# Altium schematic sheet CO2_THP_Sensor.SchDoc
size A; SheetNumber: 10; SheetTotal: 10
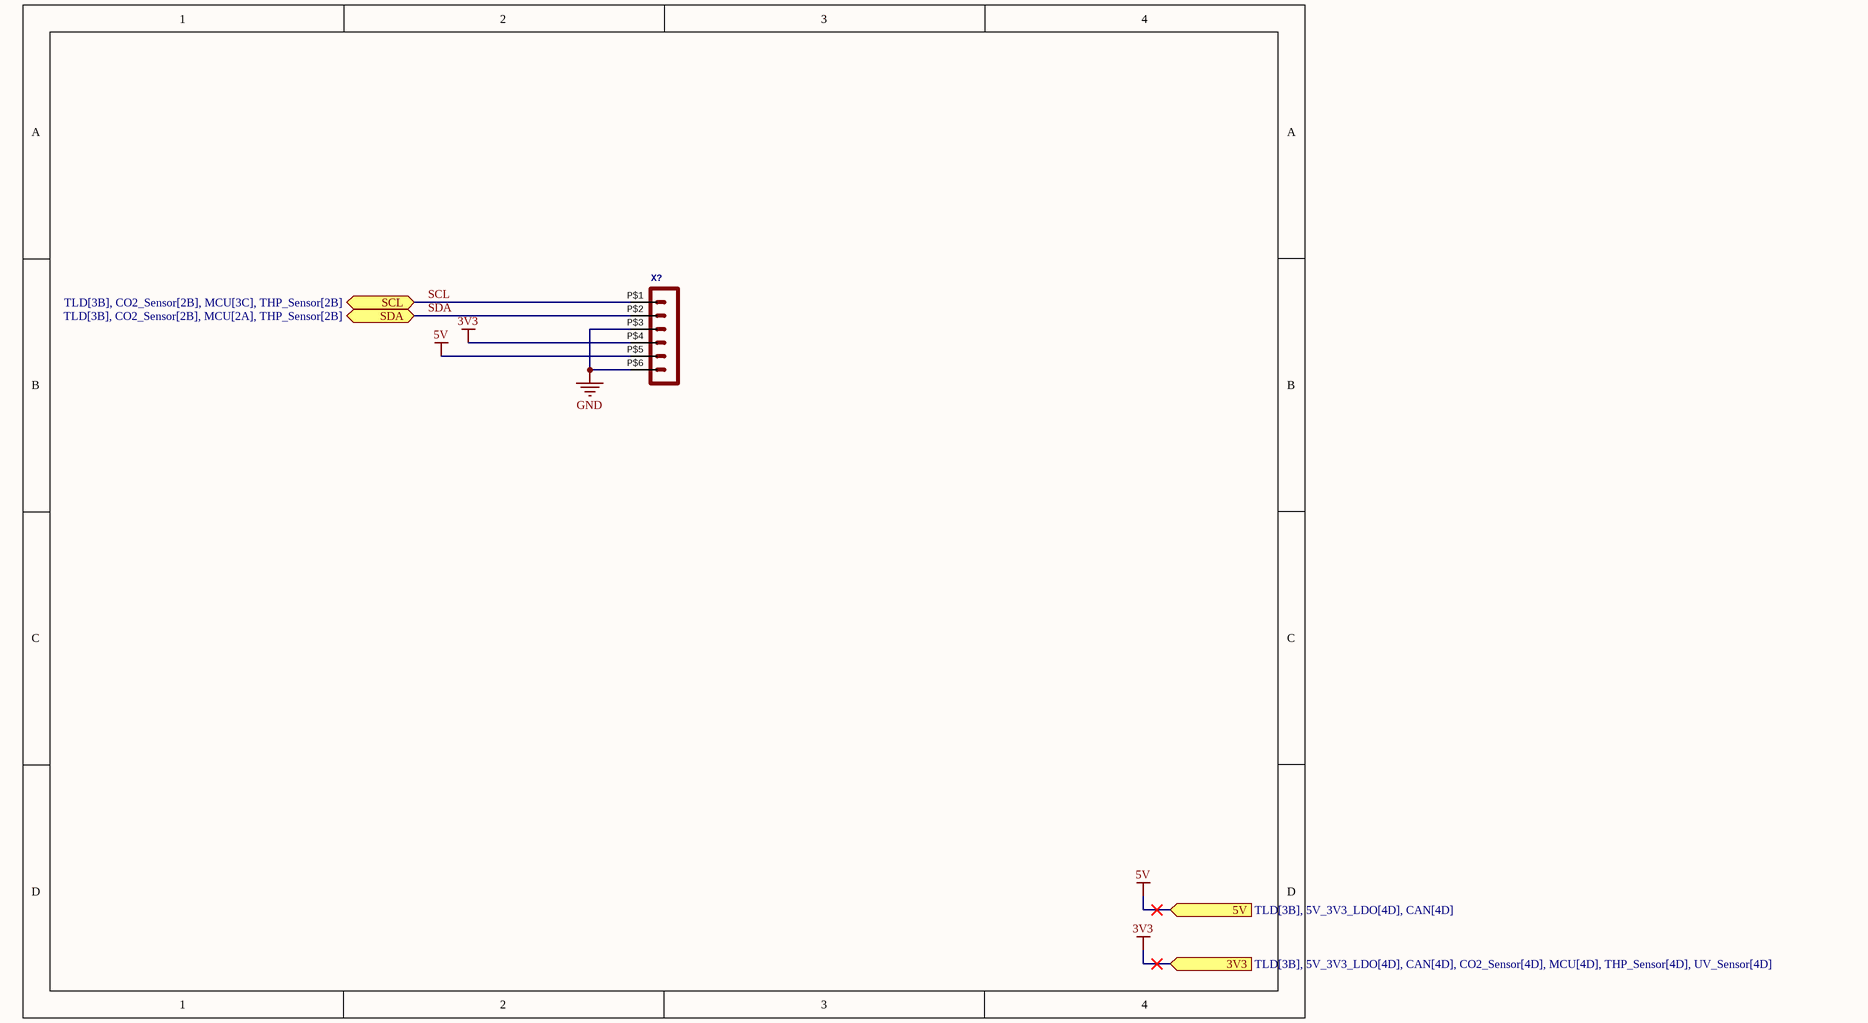
[diagram p0: CO2_THP_Sensor.SchDoc]

## Parts
X?  Molex - Micro-Fit 3.0 Series connector,  3.00mm (0.118") pitch header, 6 positions.  [44764-0601]  (value not drawn)

## Ports
3V3 (in, see TLD[3B], 5V_3V3_LDO[4D], CAN[4D], CO2_Sensor[4D], MCU[4D], THP_Sensor[4D], UV_Sensor[4D]), 5V (in, see TLD[3B], 5V_3V3_LDO[4D], CAN[4D]), SCL (bidir, see TLD[3B], CO2_Sensor[2B], MCU[3C], THP_Sensor[2B]), SDA (bidir, see TLD[3B], CO2_Sensor[2B], MCU[2A], THP_Sensor[2B])

## Nets
3V3: X?.P$4 ; port 3V3
5V: X?.P$5 ; port 5V
GND: X?.P$3 X?.P$6
SCL: X?.P$1 ; port SCL
SDA: X?.P$2 ; port SDA

## Library data of the parts
X? = HEADER_POS6_?44764-0601: GateName_1: G$1; SymbolName_1: HEADER_POS6; DeviceName: 44764-0601; LibraryName: con-molex-micro-fit-3_0_2; DeviceSetName: HEADER_POS6_?; Package: 44764-0601